# Altium schematic sheet CAN_Transciever.SchDoc
size A; SheetNumber: 2; SheetTotal: 8
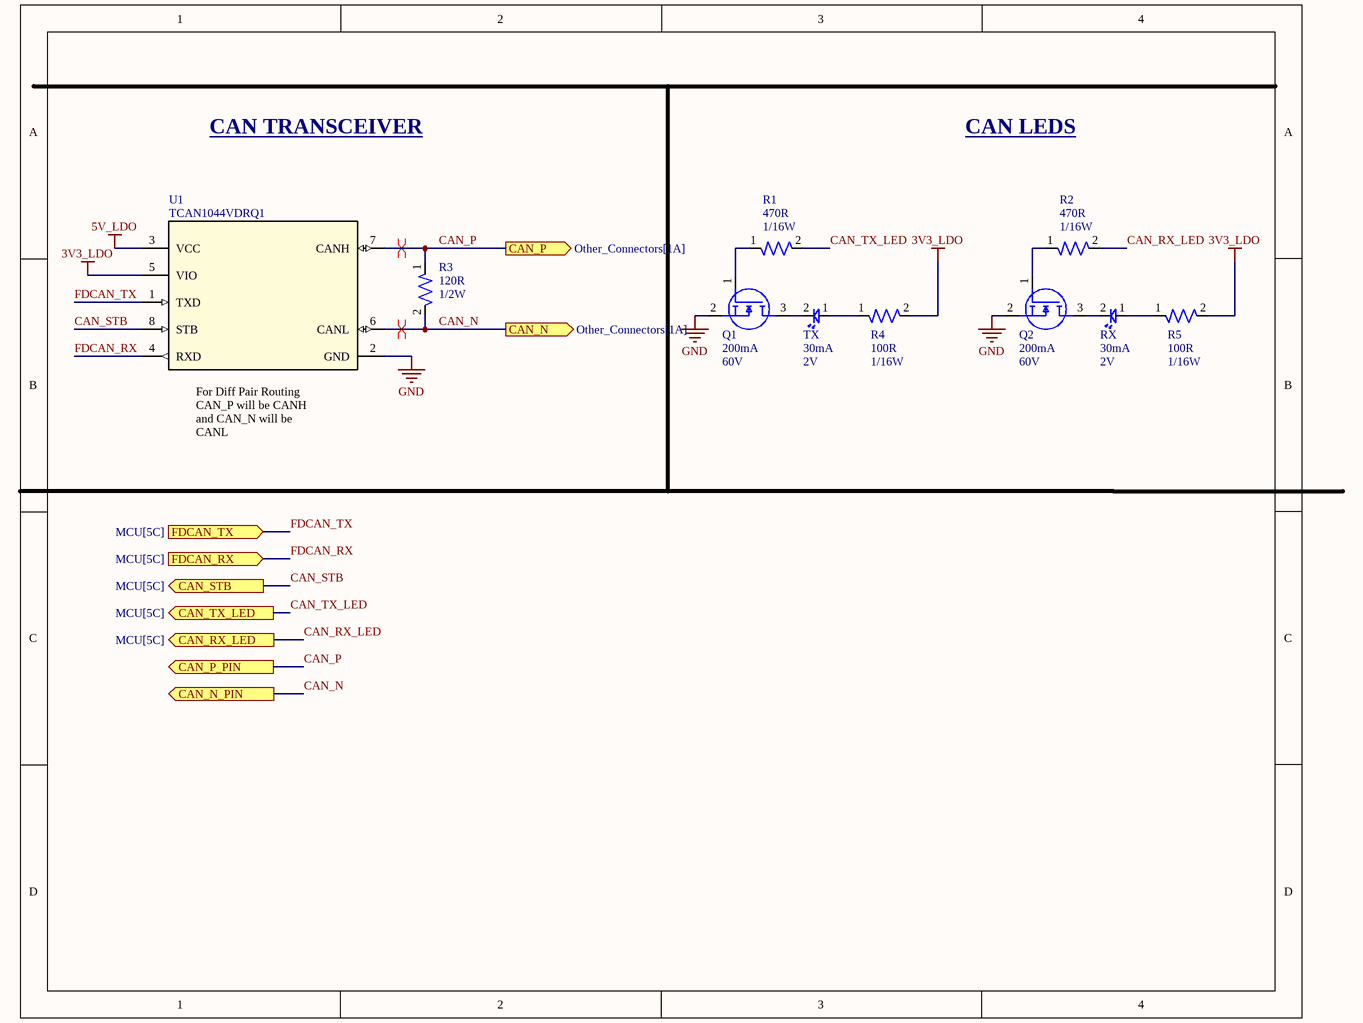
[diagram p0: CAN_Transciever.SchDoc]

## Parts
Q1  Continuous Current: 200mA  Voltage: 60V  [IC-SOT23-3]  (hidden comment: T2N7002AK,LM)
Q2  Continuous Current: 200mA  Voltage: 60V  [IC-SOT23-3]  (hidden comment: T2N7002AK,LM)
R1  Power: 1/16W  Resistance: 470R  [RES-0402]  (hidden comment: RC0402FR-07470RL)
R2  Power: 1/16W  Resistance: 470R  [RES-0402]  (hidden comment: RC0402FR-07470RL)
R3  Power: 1/2W  Resistance: 120R  [RES-1210]  (hidden comment: RC1210FR-07120RL)
R4  Power: 1/16W  Resistance: 100R  [RES-0402]  (hidden comment: RC0402FR-07100RL)
R5  Power: 1/16W  Resistance: 100R  [RES-0402]  (hidden comment: RC0402FR-07100RL)
RX  Forward Current: 30mA  Forward Voltage: 2V  [LED-0603]  (hidden comment: BL-HKC36G-AV-TRB)
TX  Forward Current: 30mA  Forward Voltage: 2V  [LED-0603]  (hidden comment: BL-HKC36G-AV-TRB)
U1  TCAN1044VDRQ1  [IC-8SOIC]

## Ports
CAN_N (out, see Other_Connectors[1A]), CAN_N_PIN (out), CAN_P (out, see Other_Connectors[1A]), CAN_P_PIN (out), CAN_RX_LED (out, see MCU[5C]), CAN_STB (out, see MCU[5C]), CAN_TX_LED (out, see MCU[5C]), FDCAN_RX (in, see MCU[5C]), FDCAN_TX (in, see MCU[5C])

## Nets
3V3_LDO: R4.2 R5.2 U1.5(VIO)
5V_LDO: U1.3(VCC)
GND: Q1.2(S) Q2.2(S) U1.2(GND)
CAN_N: R3.2 U1.6(CANL) ; port CAN_N_PIN, port CAN_N
CAN_P: R3.1 U1.7(CANH) ; port CAN_P_PIN, port CAN_P
CAN_RX_LED: R2.2 ; port CAN_RX_LED
CAN_STB: U1.8(STB) ; port CAN_STB
CAN_TX_LED: R1.2 ; port CAN_TX_LED
FDCAN_RX: U1.4(RXD) ; port FDCAN_RX
FDCAN_TX: U1.1(TXD) ; port FDCAN_TX
NetQ1_1: Q1.1(G) R1.1
NetQ1_3: Q1.3(D) TX.2
NetQ2_1: Q2.1(G) R2.1
NetQ2_3: Q2.3(D) RX.2
NetR4_1: R4.1 TX.1
NetR5_1: R5.1 RX.1

## Layout directives
differential pair: CAN_N, CAN_P

## Notes on the sheet
- CAN TRANSCEIVER
- CAN LEDS
- (near U1) For Diff Pair Routing CAN_P will be CANH and CAN_N will be CANL

## Library data of the parts
Q1 Q2 = NMOS-200MA-0001: MOSFET N-CH 60V 200MA SOT23; ComponentLink1Description: Datasheet; ComponentLink1URL: https://toshiba.semicon-storage.com/info/T2N7002AK_datasheet_en_20150401.pdf?did=29712&prodName=T2N7002AK
R1 R2 = RES-470-0001: RES 470 OHM 1% 1/16W 0402; Tolerance: 1%; Size: 0402; ComponentLink1Description: Datasheet; ComponentLink1URL: https://www.yageo.com/upload/media/product/products/datasheet/rchip/PYu-RC_Group_51_RoHS_L_12.pdf
R3 = RES-120-0001: RES 120 OHM 1% 1/2W 1210; Tolerance: 1%; Size: 1210; ComponentLink1Description: Datasheet; ComponentLink1URL: https://www.yageo.com/upload/media/product/products/datasheet/rchip/PYu-RC_Group_51_RoHS_L_12.pdf
R4 R5 = RES-100-0001: RES 100 OHM 1% 1/16W 0402; Tolerance: 1%; Size: 0402; ComponentLink1Description: Datasheet; ComponentLink1URL: https://www.yageo.com/upload/media/product/products/datasheet/rchip/PYu-RC_Group_51_RoHS_L_12.pdf
RX TX = LED-0001: LED YELLOW CLEAR 0603 SMD; ComponentLink1Description: Datasheet; ComponentLink1URL: https://www.americanbrightled.com/pdffiles/led-components/smt/BL-HKC36G-AV-TRB.pdf
U1 = IC-CAN-0001: IC TRANSCEIVER 1/1 8SOIC; ComponentLink1Description: Datasheet; ComponentLink1URL: https://www.ti.com/lit/ds/symlink/tcan1044-q1.pdf?HQS=dis-dk-null-digikeymode-dsf-pf-null-wwe&ts=1728758303289&ref_url=https%253A%252F%252Fwww.ti.com%252Fgeneral%252Fdocs%252Fsuppproductinfo.tsp%253FdistId%253D10%2526gotoUrl%253Dhttps%253A%252F%252Fwww.ti.com%252Flit%252Fgpn%252Ftcan1044-q1